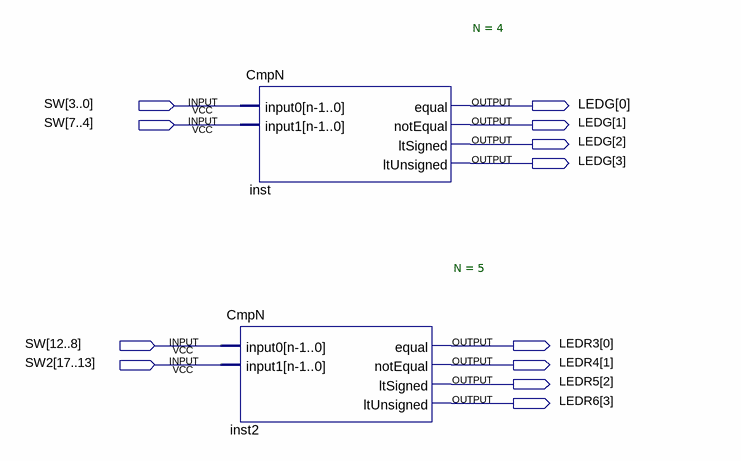
[diagram p0: schematic sheet]
// Quartus schematic CmpN_Demo.bdf as structural Verilog: 2 symbols, 12 pins
module CmpN_Demo (
  input  [12:0] SW,
  input  [17:13] SW2,
  output [3:0] LEDG,
  output [0:0] LEDR3,
  output [1:1] LEDR4,
  output [2:2] LEDR5,
  output [3:3] LEDR6
);

  CmpN #(.N(4)) inst (
    .input0(SW[3:0]), .input1(SW[7:4]), .equal(LEDG[0]), .notEqual(LEDG[1]), .ltSigned(LEDG[2]),
    .ltUnsigned(LEDG[3]));
  CmpN #(.N(5)) inst2 (
    .input0(SW[12:8]), .input1(SW2), .equal(LEDR3[0]), .notEqual(LEDR4[1]), .ltSigned(LEDR5[2]),
    .ltUnsigned(LEDR6[3]));
endmodule
